# EasyEDA schematic DCC Signal Input.json
TITLE: DCC Signal Detector; REV: 1.0; Date: 2022-11-20; Sheet: 1/1; Drawn By: helmut-f; Company: Your Company
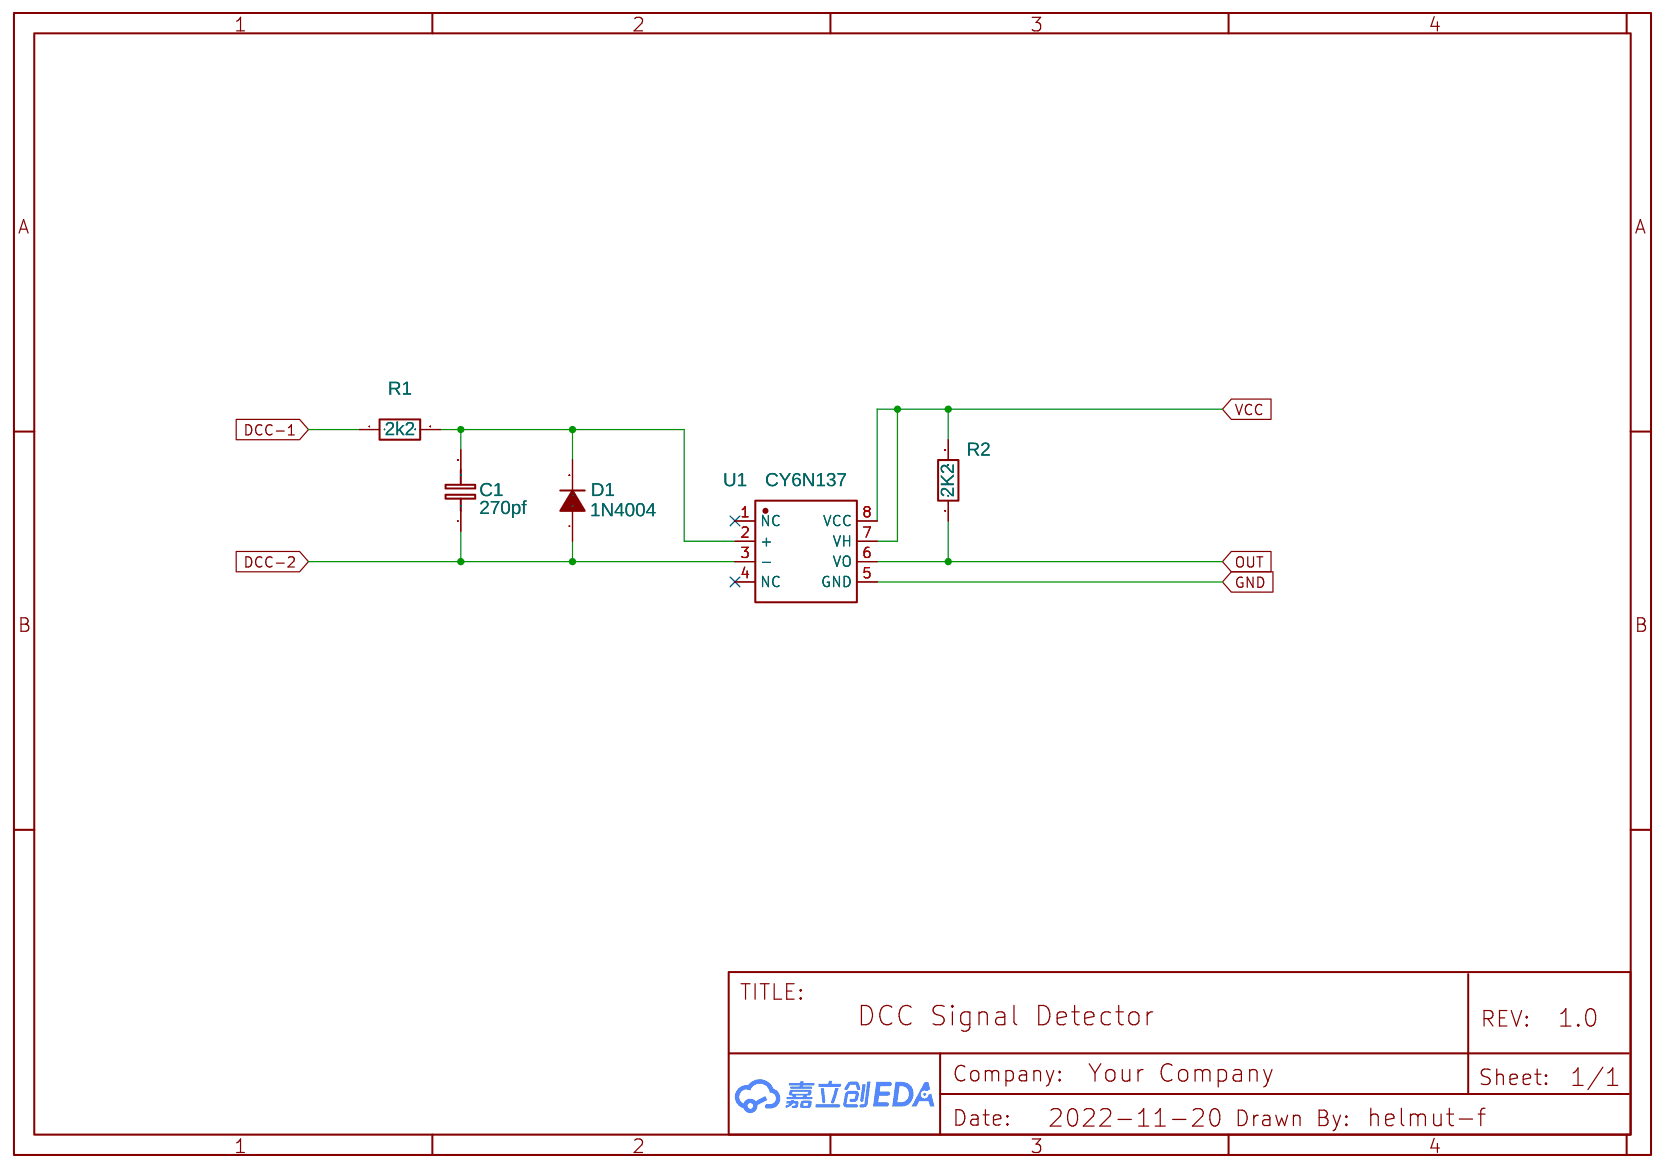
[diagram p0: schematic sheet]

## Parts
C1  270pf  [RAD-0.2]
D1  1N4004  [DO-41_BD2.4-L4.7-P8.70-D0.9-FD]
R1  2k2  [R_AXIAL-0.3]
R2  2K2  [R_AXIAL-0.3]
U1  CY6N137  [DIP-8_L9.8-W6.6-P2.54-LS7.6-BL]

## Library data of the parts
C1 = C_RAD-0.2_EU: Contributor: LCEDA_Lib
D1 = 1N4004: Supplier: LCSC; Manufacturer: MDD; Supplier Part: C3058; JLCPCB Part Class: Extended Part
R1 R2 = R_AXIAL-0.3_EU: Contributor: LCEDA_Lib
U1 = CY6N137: Supplier: LCSC; Supplier Part: C970352; Manufacturer: OCIC; Contributor: LCSC; JLCPCB Part Class: Extended Part

## Nets
GND: U1.5(GND)
VCC: R2.2 U1.7(VH) U1.8(VCC)
DCC-1: R1.1
DCC-2: C1.1 D1.1(A) U1.3(-)
OUT: R2.1 U1.6(VO)
Net-(C1-2): C1.2 D1.2(K) R1.2 U1.2(+)

Not connected (* = marked no-connect by the designer): U1 1(NC)* 4(NC)*
